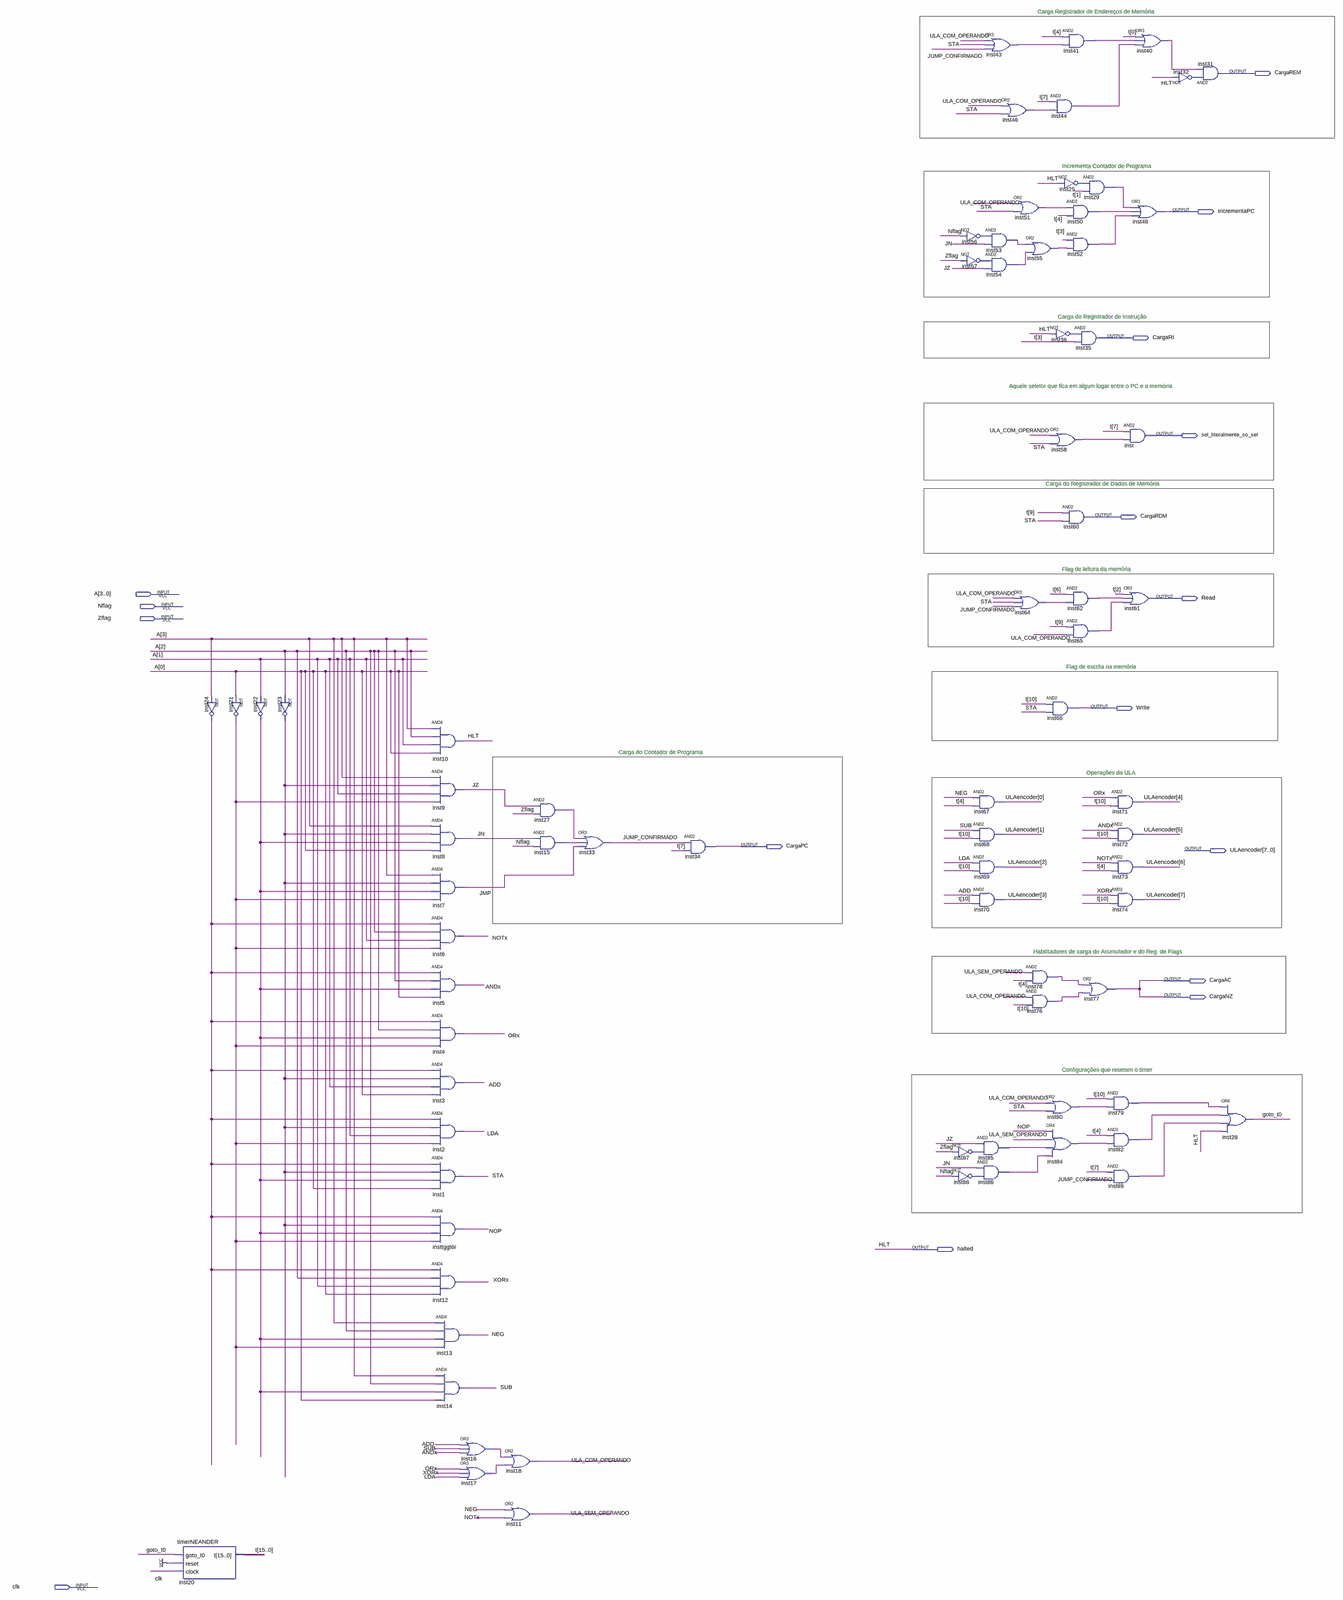
[diagram p0: schematic sheet, whole]
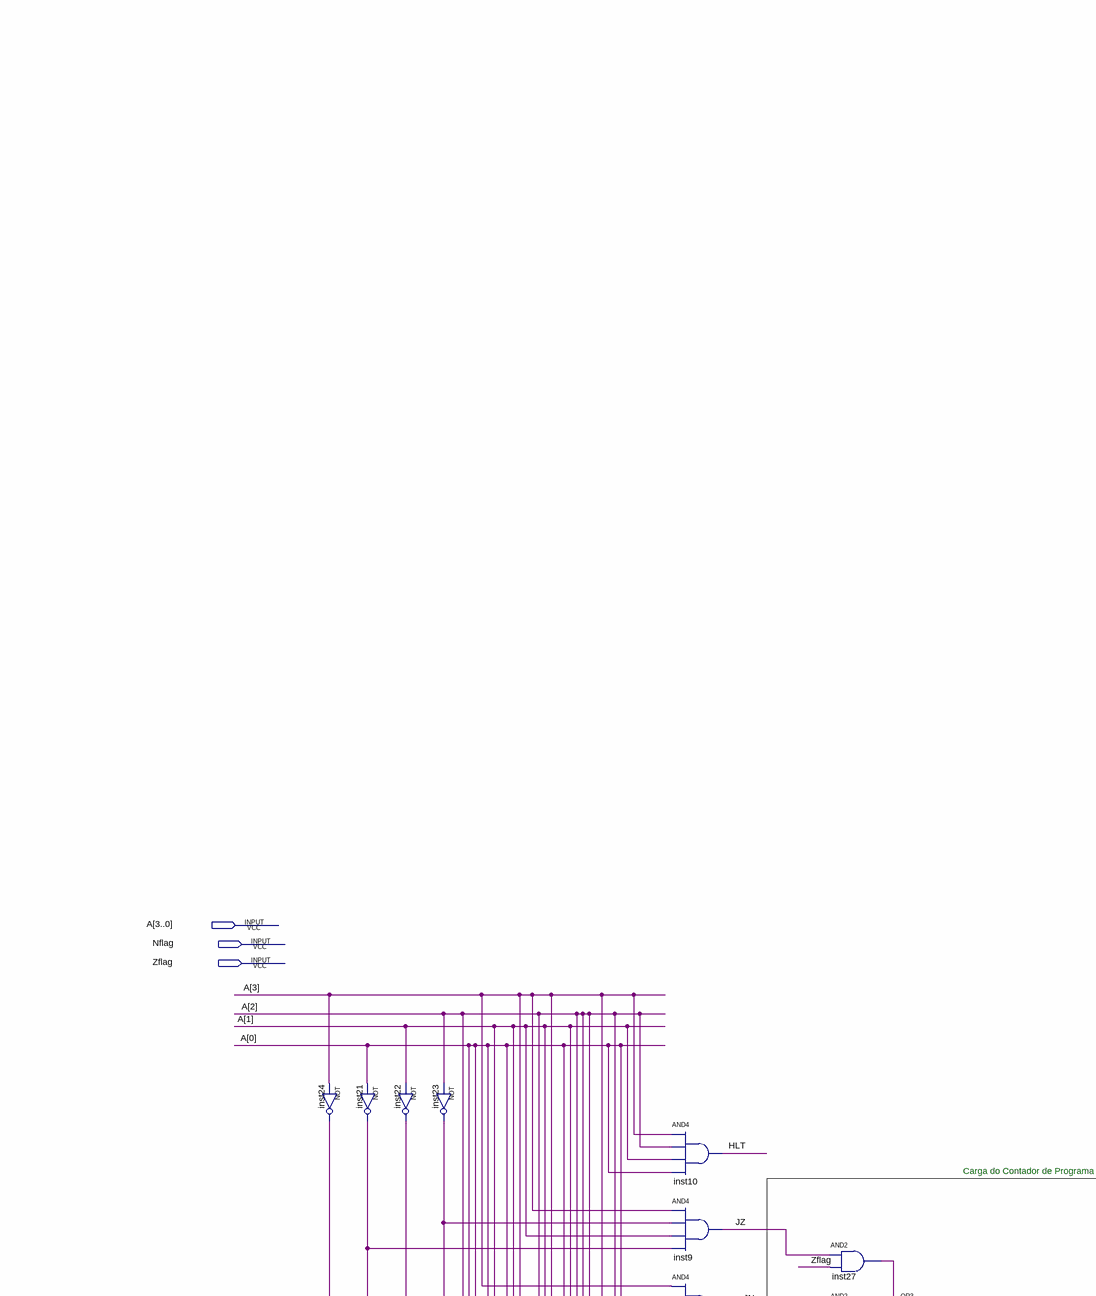
[diagram p1: schematic sheet, upper left part]
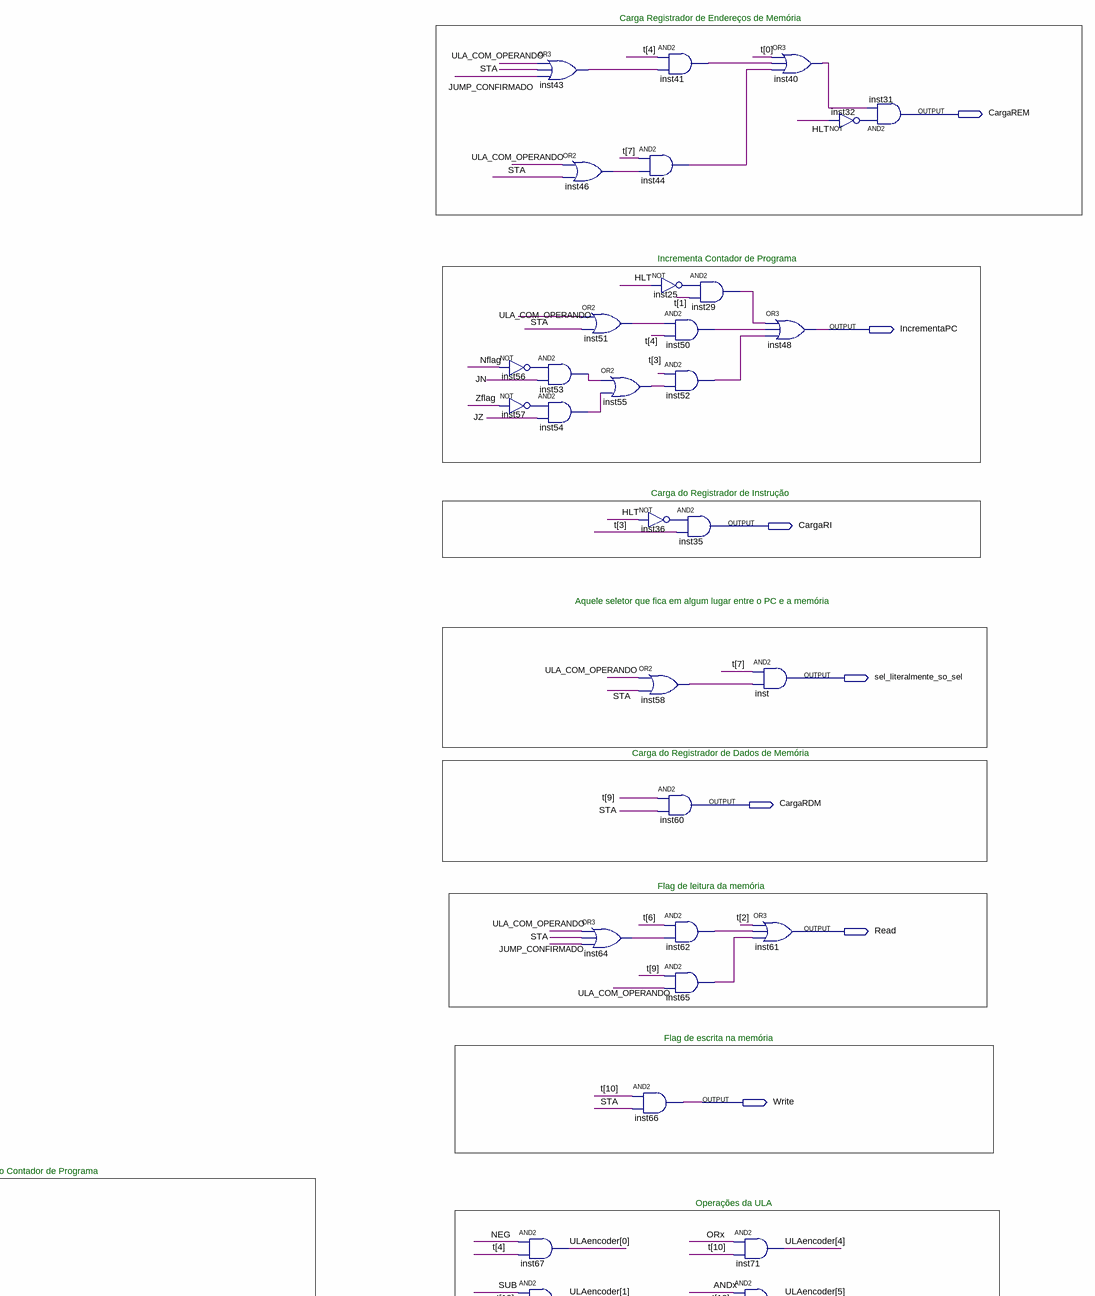
[diagram p2: schematic sheet, upper right part]
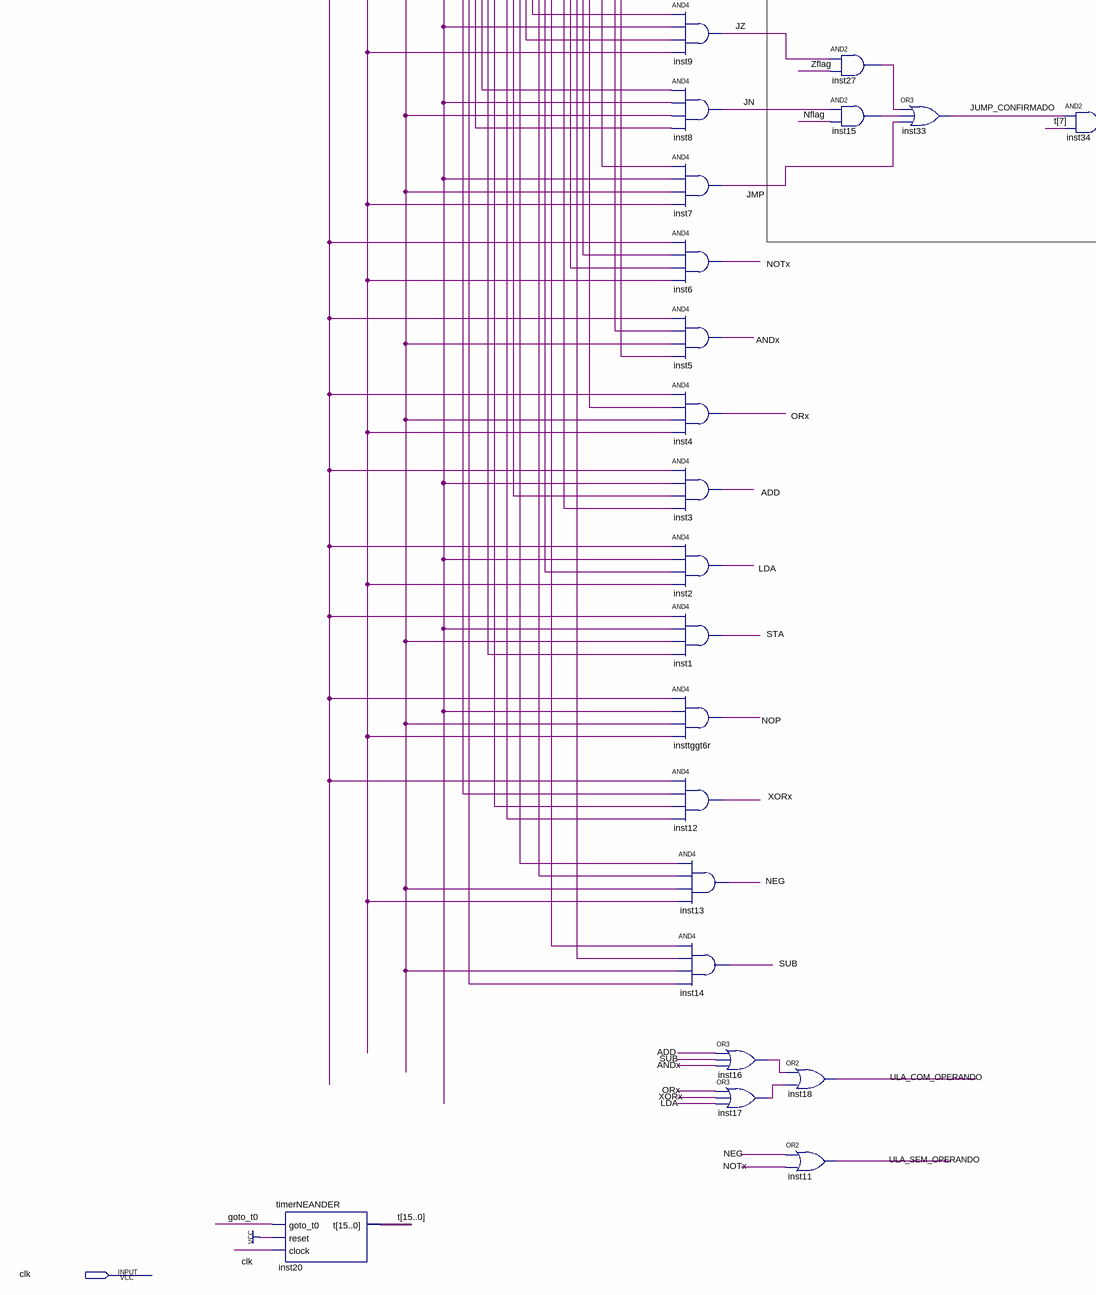
[diagram p3: schematic sheet, lower left part]
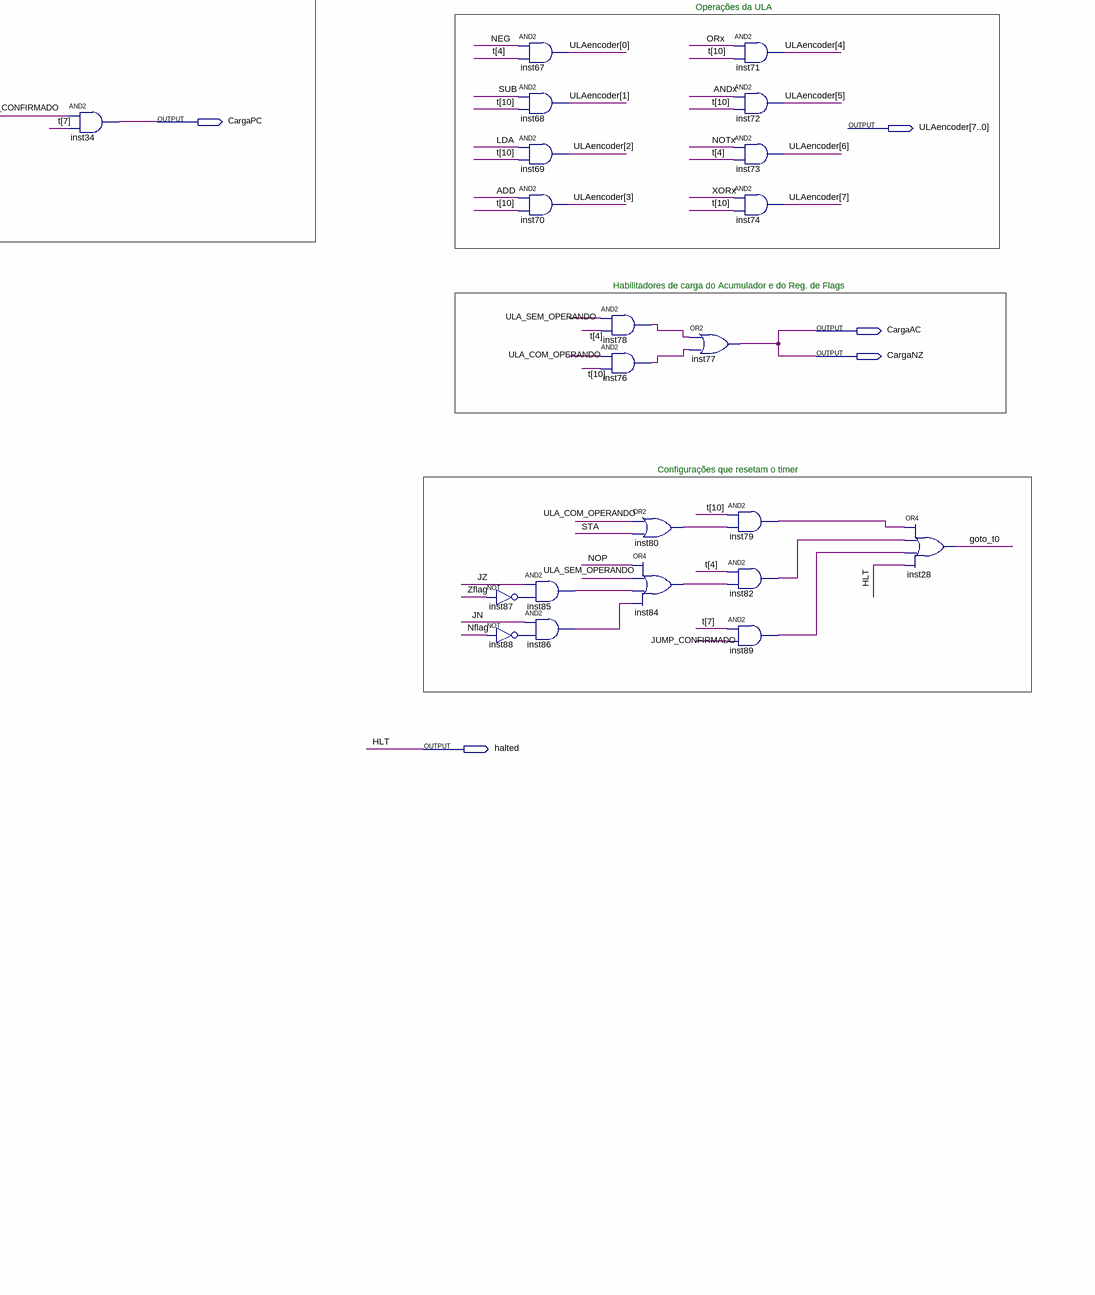
[diagram p4: schematic sheet, lower right part]
// Quartus schematic decoderNEANDER.bdf as structural Verilog: 76 symbols, 16 pins
module decoderNEANDER (
  input  [3:0] A,
  input  Nflag,
  input  Zflag,
  input  clk,
  output CargaREM,
  output IncrementaPC,
  output CargaRI,
  output sel_literalmente_so_sel,
  output CargaRDM,
  output Read,
  output Write,
  output CargaPC,
  output [7:0] ULAencoder,
  output CargaAC,
  output CargaNZ,
  output halted
);

  wire ADD, ANDx, goto_t0, inst15_out, inst16_out, inst17_out, inst21_out, inst22_out, inst23_out,
       inst24_out, inst25_out, inst27_out, inst29_out, inst32_out, inst36_out, inst40_out, inst41_out,
       inst43_out, inst44_out, inst46_out, inst50_out, inst51_out, inst52_out, inst53_out, inst54_out,
       inst55_out, inst56_out, inst57_out, inst58_out, inst62_out, inst64_out, inst65_out, inst76_out,
       inst78_out, inst79_out, inst80_out, inst82_out, inst84_out, inst85_out, inst86_out, inst87_out,
       inst88_out, inst89_out, JMP, JN, JUMP_CONFIRMADO, JZ, LDA, NEG, NOP, NOTx, ORx, STA, SUB,
       ULA_COM_OPERANDO, ULA_SEM_OPERANDO, XORx;
  wire [15:0] t;

  timerNEANDER inst20 (.goto_t0(goto_t0), .reset(1'b1), .clock(clk), .t(t));
  not inst24 (inst24_out, A[3]);
  not inst21 (inst21_out, A[0]);
  not inst22 (inst22_out, A[1]);
  not inst23 (inst23_out, A[2]);
  and inst10 (halted, A[3], A[2], A[1], A[0]);
  and inst9 (JZ, A[3], inst23_out, A[1], inst21_out);
  and inst8 (JN, A[3], inst23_out, inst22_out, A[0]);
  and inst7 (JMP, A[3], inst23_out, inst22_out, inst21_out);
  and inst6 (NOTx, inst24_out, A[2], A[1], inst21_out);
  and inst5 (ANDx, inst24_out, A[2], inst22_out, A[0]);
  and inst4 (ORx, inst24_out, A[2], inst22_out, inst21_out);
  and inst3 (ADD, inst24_out, inst23_out, A[1], A[0]);
  and inst2 (LDA, inst24_out, inst23_out, A[1], inst21_out);
  and inst1 (STA, inst24_out, inst23_out, inst22_out, A[0]);
  and insttggt6r (NOP, inst24_out, inst23_out, inst22_out, inst21_out);
  and inst12 (XORx, inst24_out, A[2], A[1], A[0]);
  and inst13 (NEG, A[3], A[2], inst22_out, inst21_out);
  and inst14 (SUB, A[3], A[2], inst22_out, A[0]);
  or inst16 (inst16_out, ADD, SUB, ANDx);
  or inst17 (inst17_out, ORx, XORx, LDA);
  or inst18 (ULA_COM_OPERANDO, inst16_out, inst17_out);
  or inst11 (ULA_SEM_OPERANDO, NEG, NOTx);
  and inst27 (inst27_out, JZ, Zflag);
  and inst15 (inst15_out, JN, Nflag);
  or inst33 (JUMP_CONFIRMADO, inst27_out, inst15_out, JMP);
  and inst34 (CargaPC, JUMP_CONFIRMADO, t[7]);
  not inst56 (inst56_out, Nflag);
  not inst57 (inst57_out, Zflag);
  not inst87 (inst87_out, Zflag);
  not inst88 (inst88_out, Nflag);
  or inst43 (inst43_out, ULA_COM_OPERANDO, STA, JUMP_CONFIRMADO);
  and inst53 (inst53_out, inst56_out, JN);
  and inst54 (inst54_out, inst57_out, JZ);
  and inst67 (ULAencoder[0], NEG, t[4]);
  and inst68 (ULAencoder[1], SUB, t[10]);
  and inst69 (ULAencoder[2], LDA, t[10]);
  and inst70 (ULAencoder[3], ADD, t[10]);
  and inst85 (inst85_out, JZ, inst87_out);
  and inst86 (inst86_out, JN, inst88_out);
  or inst46 (inst46_out, ULA_COM_OPERANDO, STA);
  or inst51 (inst51_out, ULA_COM_OPERANDO, STA);
  or inst55 (inst55_out, inst53_out, inst54_out);
  or inst64 (inst64_out, ULA_COM_OPERANDO, STA, JUMP_CONFIRMADO);
  and inst78 (inst78_out, ULA_SEM_OPERANDO, t[4]);
  and inst76 (inst76_out, ULA_COM_OPERANDO, t[10]);
  and inst44 (inst44_out, t[7], inst46_out);
  not inst25 (inst25_out, halted);
  not inst36 (inst36_out, halted);
  or inst58 (inst58_out, ULA_COM_OPERANDO, STA);
  and inst66 (Write, t[10], STA);
  or inst80 (inst80_out, ULA_COM_OPERANDO, STA);
  or inst84 (inst84_out, NOP, ULA_SEM_OPERANDO, inst85_out, inst86_out);
  and inst41 (inst41_out, t[4], inst43_out);
  and inst29 (inst29_out, inst25_out, t[1]);
  and inst50 (inst50_out, inst51_out, t[4]);
  and inst52 (inst52_out, t[3], inst55_out);
  and inst35 (CargaRI, inst36_out, t[3]);
  and inst60 (CargaRDM, t[9], STA);
  and inst62 (inst62_out, t[6], inst64_out);
  and inst65 (inst65_out, t[9], ULA_COM_OPERANDO);
  or inst77 (CargaAC, inst78_out, inst76_out);
  and inst (sel_literalmente_so_sel, t[7], inst58_out);
  or inst61 (Read, t[2], inst62_out, inst65_out);
  and inst71 (ULAencoder[4], ORx, t[10]);
  and inst72 (ULAencoder[5], ANDx, t[10]);
  and inst73 (ULAencoder[6], NOTx, t[4]);
  and inst74 (ULAencoder[7], XORx, t[10]);
  and inst79 (inst79_out, t[10], inst80_out);
  and inst82 (inst82_out, t[4], inst84_out);
  and inst89 (inst89_out, t[7], JUMP_CONFIRMADO);
  or inst40 (inst40_out, t[0], inst41_out, inst44_out);
  or inst48 (IncrementaPC, inst29_out, inst50_out, inst52_out);
  not inst32 (inst32_out, halted);
  and inst31 (CargaREM, inst32_out, inst40_out);
  or inst28 (goto_t0, inst79_out, inst82_out, inst89_out, halted);

  assign CargaNZ = CargaAC;

  // Other names for the same wires on the sheet: HLT = halted

  // Notes on the sheet:
  //   Carga Registrador de Endereços de Memória
  //   Incrementa Contador de Programa
  //   Carga do Registrador de Instrução
  //   Aquele seletor que fica em algum lugar entre o PC e a memória
  //   Carga do Registrador de Dados de Memória
  //   Flag de leitura da memória
  //   Flag de escrita na memória
  //   Carga do Contador de Programa
  //   Operações da ULA
  //   Habilitadores de carga do Acumulador e do Reg. de Flags
  //   Configurações que resetam o timer
endmodule
